# Altium project rs422-to-fiber.PrjPcb
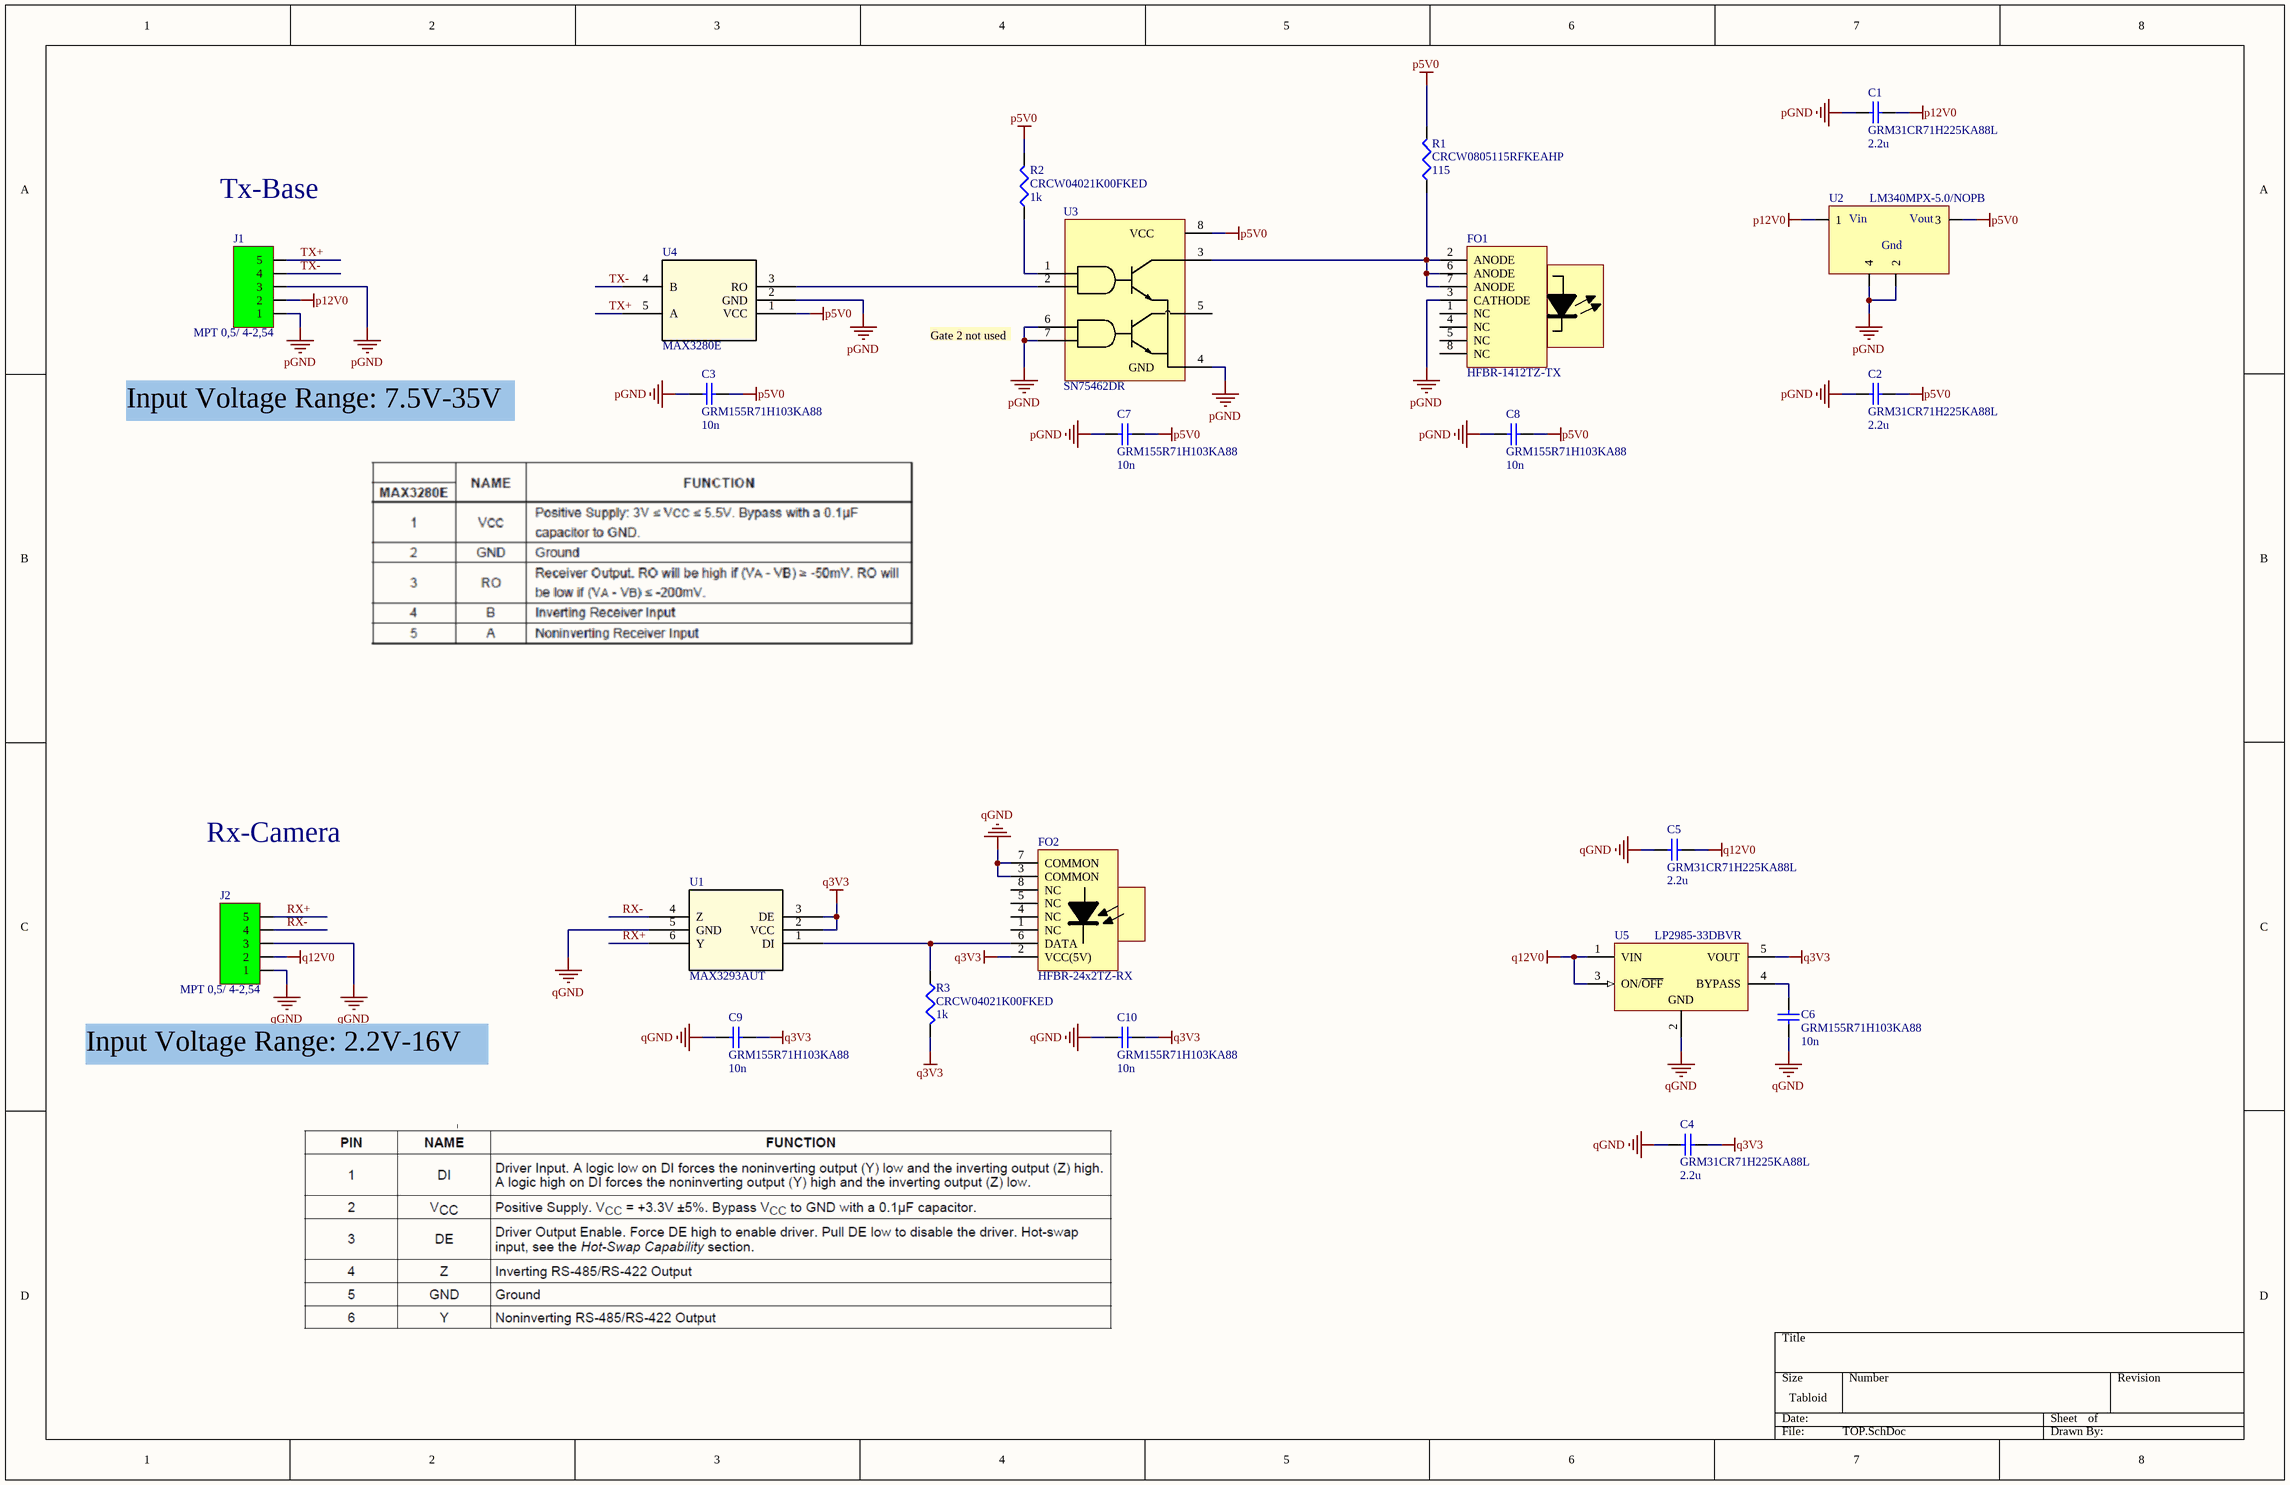
[diagram p0: TOP.SchDoc]
1 sheet, 22 parts. Net scope: strictly hierarchical (ports join the sheet entries above them; power ports are local).
Board file: xxx-xx-xxxx.PcbDoc

## Sheet TOP.SchDoc
size Tabloid

### Parts
C1  GRM31CR71H225KA88L  value 2.2u  [1206]
C2  GRM31CR71H225KA88L  value 2.2u  [1206]
C3  GRM155R71H103KA88  value 10n  [0402]
C4  GRM31CR71H225KA88L  value 2.2u  [1206]
C5  GRM31CR71H225KA88L  value 2.2u  [1206]
C6  GRM155R71H103KA88  value 10n  [0402]
C7  GRM155R71H103KA88  value 10n  [0402]
C8  GRM155R71H103KA88  value 10n  [0402]
C9  GRM155R71H103KA88  value 10n  [0402]
C10  GRM155R71H103KA88  value 10n  [0402]
FO1  HFBR-1412TZ-TX  [HFBR-x41xTZ]
FO2  HFBR-24x2TZ-RX  [HFBR-x41xTZ]
J1  MPT 0,5/ 4-2,54  [MPT 0,5/ 5-2,54]
J2  MPT 0,5/ 4-2,54  [MPT 0,5/ 5-2,54]
R1  CRCW0805115RFKEAHP  value 115  [0805]
R2  CRCW04021K00FKED  value 1k  [0402]
R3  CRCW04021K00FKED  value 1k  [0402]
U1  MAX3293AUT  [SOT23-6]
U2  LM340MPX-5.0/NOPB  [LM340MPX-5.0/NOPB]
U3  SN75462DR  [SOP-8]
U4  MAX3280E  [SOT23-5]
U5  LP2985-33DBVR  [TI-DBV5_V]

### Nets
p5V0: C2.2 C3.2 C7.2 C8.2 R1.2 R2.2 U2.3 U3.8(VCC) U4.1(VCC)
p12V0: C1.2 J1.2 U2.1
pGND: C1.1 C2.1 C3.1 C7.1 C8.1 FO1.3(CATHODE) J1.1 J1.3 U2.2 U2.4 U3.4(GND) U3.6(2A) U3.7(2B) U4.2(GND)
q3V3: C4.2 C9.2 C10.2 FO2.2(VCC(5V)) R3.2 U1.2(VCC) U1.3(DE) U5.5(VOUT)
q12V0: C5.2 J2.2 U5.1(VIN) U5.3(ON/~{OFF})
qGND: C4.1 C5.1 C6.1 C9.1 C10.1 FO2.3(COMMON) FO2.7(COMMON) J2.1 J2.3 U1.5(GND) U5.2(GND)
RX+: J2.5 U1.6(Y)
RX-: J2.4 U1.4(Z)
TX+: J1.5 U4.5(A)
TX-: J1.4 U4.4(B)
NetC6_2: C6.2 U5.4(BYPASS)
NetFO1_2: FO1.2(ANODE) FO1.6(ANODE) FO1.7(ANODE) R1.1 U3.3(1Y)
NetFO2_6: FO2.6(DATA) R3.1 U1.1(DI)
NetR2_1: R2.1 U3.1(1A)
NetU3_2: U3.2(1B) U4.3(RO)

Not connected (* = marked no-connect by the designer): FO1 1(NC) 4(NC) 5(NC) 8(NC); FO2 1(NC) 4(NC) 5(NC) 8(NC); U3 5(2Y)

### Notes on the sheet
- Tx-Base
- Gate 2 not used
- Input Voltage Range: 7.5V-35V
- Rx-Camera
- Input Voltage Range: 2.2V-16V
- (in symbol LM340MPX-5.0/NOPB) Vin; Vout; Gnd

### Library data of the parts
C1 C2 C4 C5 = GRM31CR71HxxxKdddd: -55-125C, 3216, 50V, X7R, ±10%
C3 C6-C10 = GRM155R71HxxxKdddd: -55-125C, 1005, 50V, X7R, ±10%
FO1 = HFBR-14x2TZ-TX: HFBR-14x2TZ-TX fiber optic threaded ST port
FO2 = HFBR-24x2TZ-RX: HFBR-24x2TZ-RX fiber optic ST receiver
J1 J2 = MPT 0,5/ 5-2,54
R1 = R-MISC: 0.125W, -55-155C, 1005, 50V, ±1%
R2 R3 = CRCW0402xxxxFKED: 0.125W, -55-155C, 1005, 50V, ±1%
U1 = MAX3293AUT: No Description Available; Manufacturer_Part_Number: MAX3293AUT+; Vendor: Maxim Integrated Products; Built_By: EMA_UL_Team; SourceLibrary: Maxim_2014-05-21; Revision: 1; Copyright: Copyright (C) 2018 Accelerated Designs. All rights reserved; RefDes: RefDes; Type: DEV
U3 = SN75462DR: NAND Dual Peripheral drivers, SMT
U4 = MAX3280E: Manufacturer_Part_Number: MAX3293AUT+; Vendor: Maxim Integrated Products; Built_By: EMA_UL_Team; SourceLibrary: Maxim_2014-05-21; Revision: 1; Copyright: Copyright (C) 2018 Accelerated Designs. All rights reserved; RefDes: RefDes; Type: DEV
U5 = CMP-019-00026-1: Single Output Low Noise LDO, 150 mA, Fixed 3.3 V Output, 1.5% Tolerance, 2.2 to 16 V Input, Low IQ, 5-Pin SOT-23 (DBV), -40 to 125 degC, Green (RoHS & no Sb/Br), Tape and Reel; Manufacturer: Texas Instruments; Outputs: 1; Max Input Voltage: 16V; Min Input Voltage: 2.2V; Nominal Output Voltage: 3.3V; Output Current: 150mA; Package Version: 4073253-4/N, 12/2014; Dropout Voltage: 3mV; Datasheet URL: http://www.ti.com/lit/ds/symlink/lp2985-50.pdf; Pins: 16; Packaging: TapeandReel; Max Operating Temperature: 125°C; Package Description: 5-Pin Small Outline Transistor, Body 2.9 x 1.6 mm, Pitch 0.95 mm; Output Voltage: 3.3V; Case/Package: SOT-23-5; Manufacturer URL: http://www.ti.com/; Mounting Technology: SM; Package Quantity: 3000; Min Operating Temperature: -40°C; RoHS Compliant: True; Datasheet Version: SLVS522O, 01/2015; Package URL: http://www.ti.com/lit/ml/mpds018l/mpds018l.pdf; Package Reference: DBV5; Max Ouput Current: 150mA